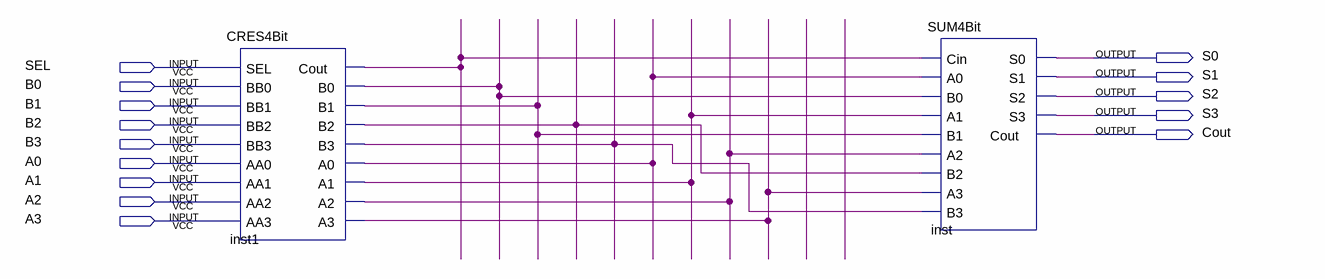
[diagram p0: schematic sheet]
// Quartus schematic SUMRES4Bit.bdf as structural Verilog: 2 symbols, 14 pins
module SUMRES4Bit (
  input  SEL,
  input  B0,
  input  B1,
  input  B2,
  input  B3,
  input  A0,
  input  A1,
  input  A2,
  input  A3,
  output S0,
  output S1,
  output S2,
  output S3,
  output Cout
);

  wire inst1_a0, inst1_a1, inst1_a2, inst1_a3, inst1_b0, inst1_b1, inst1_b2, inst1_b3, inst1_cout;

  CRES4Bit inst1 (
    .SEL(SEL), .BB0(B0), .BB1(B1), .BB2(B2), .BB3(B3), .AA0(A0), .AA1(A1), .AA2(A2), .AA3(A3),
    .Cout(inst1_cout), .B0(inst1_b0), .B1(inst1_b1), .B2(inst1_b2), .B3(inst1_b3), .A0(inst1_a0),
    .A1(inst1_a1), .A2(inst1_a2), .A3(inst1_a3));
  SUM4Bit inst (
    .Cin(inst1_cout), .A0(inst1_a0), .B0(inst1_b0), .A1(inst1_a1), .B1(inst1_b1), .A2(inst1_a2),
    .B2(inst1_b2), .A3(inst1_a3), .B3(inst1_b3), .S0(S0), .S1(S1), .S2(S2), .S3(S3), .Cout(Cout));
endmodule
